# EAGLE design NRF52 CTAP Authenticator (EAGLE 9.6.2)
DRAWN: Steffensky; REV: A
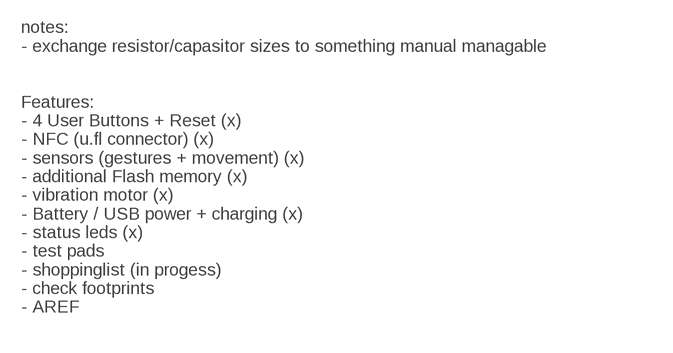
[diagram p0: schematic, sheet 1, part 1 of 2]
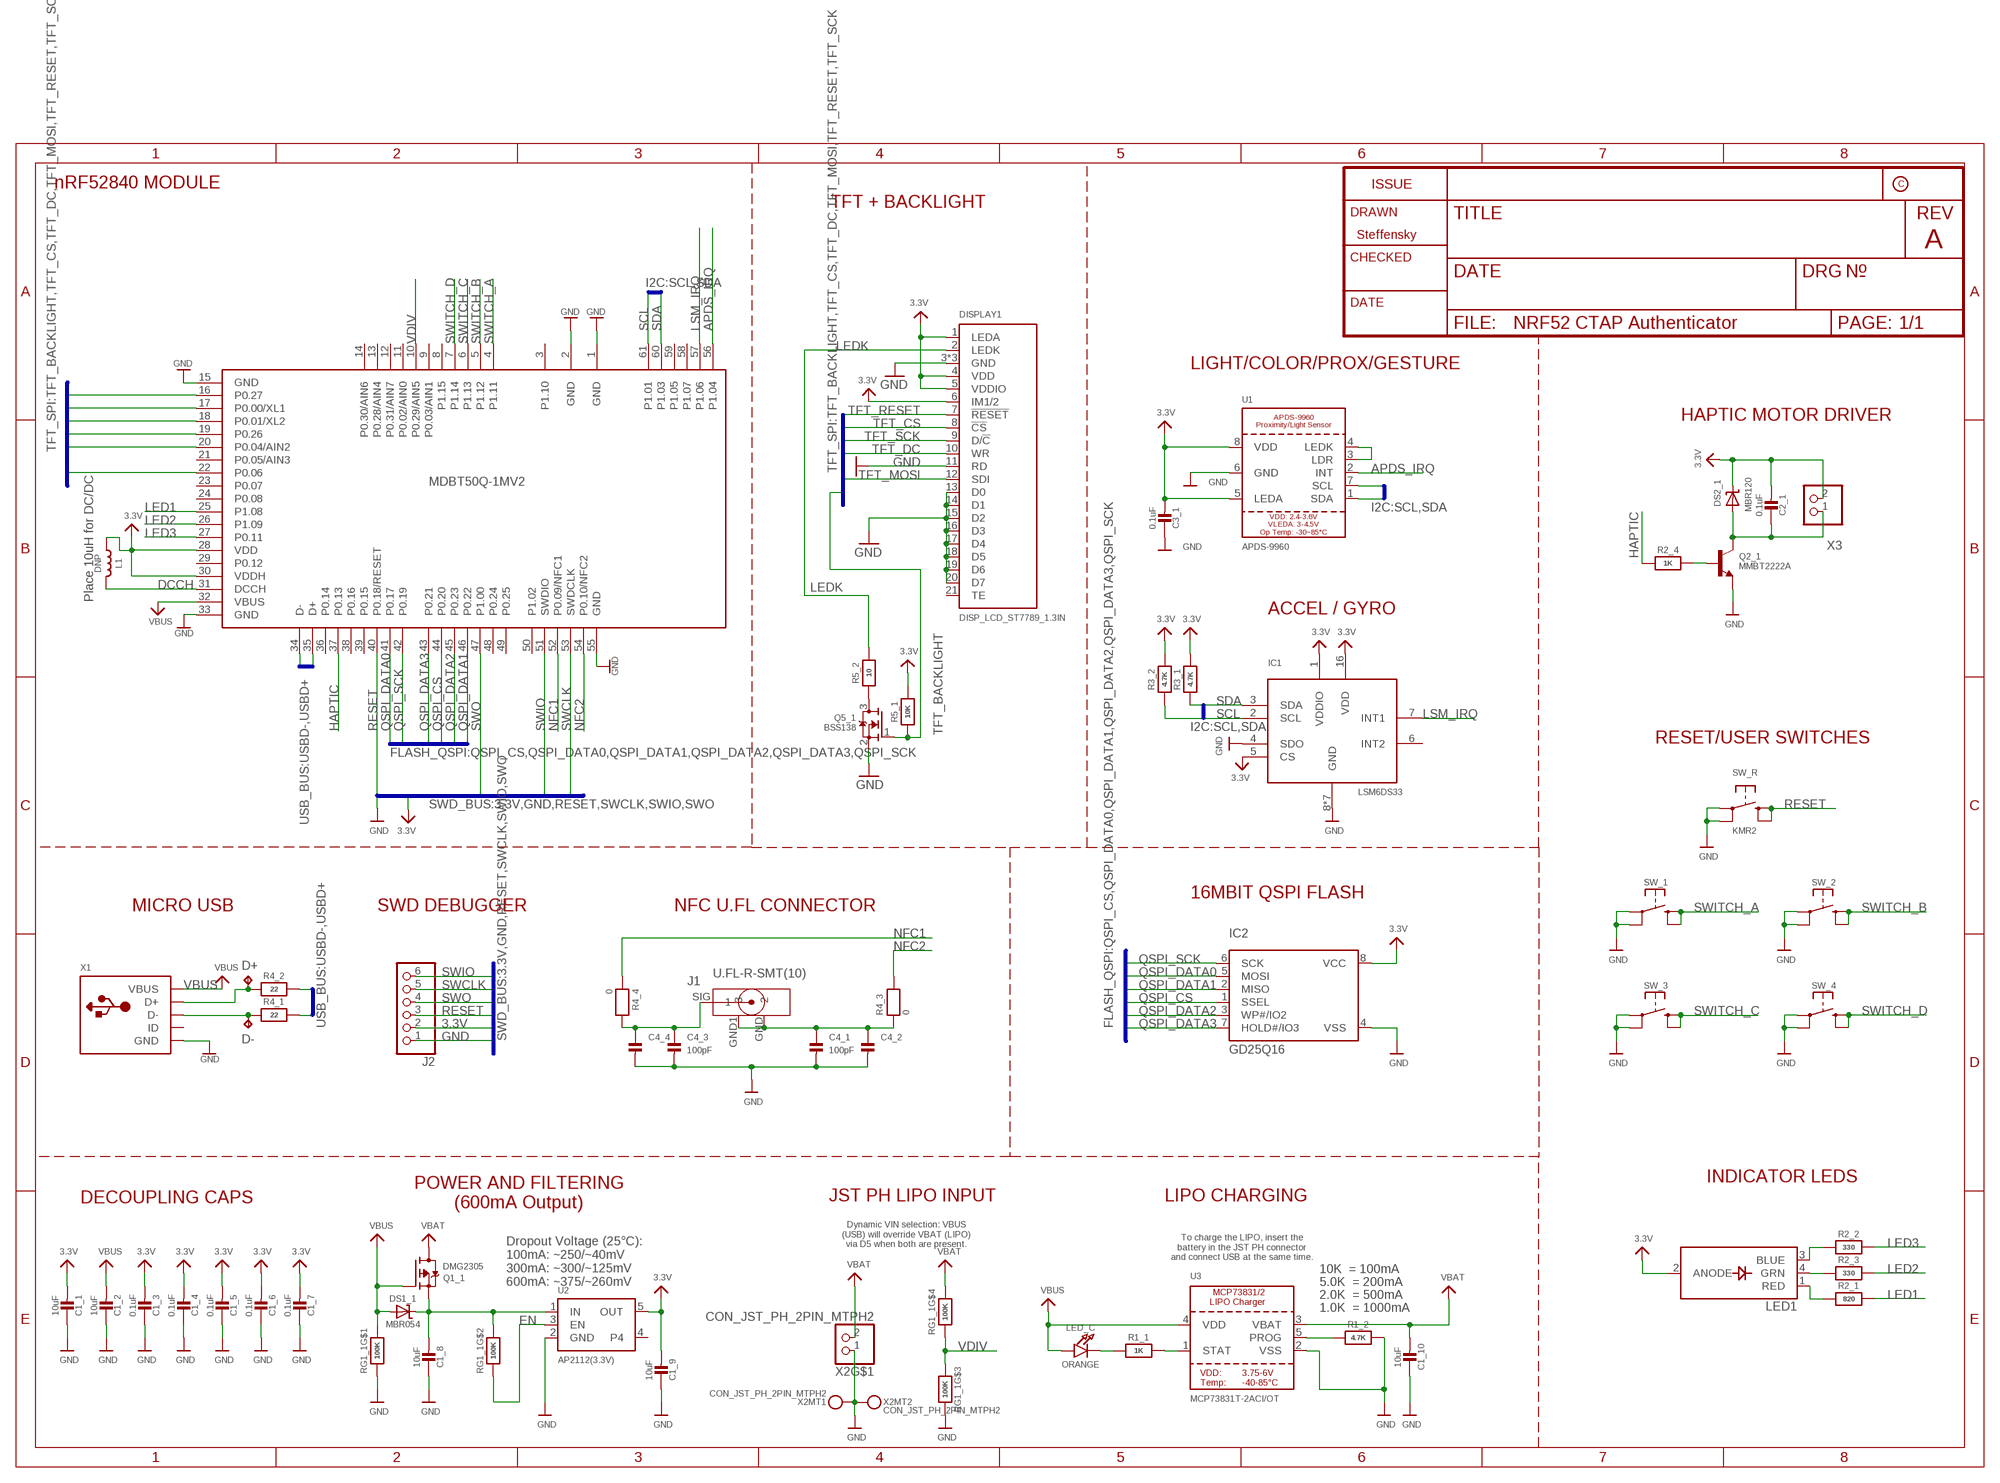
[diagram p1: schematic, sheet 1, part 2 of 2]
FRAME1 (FRAME_A3): DRAWN: Steffensky; REV: A

## Parts
C1_1  10uF  CAP_CERAMIC0805-NOTHERMALS  [0805_NOTHERMALS]
C1_2  10uF  CAP_CERAMIC0805-NOTHERMALS  [0805_NOTHERMALS]
C1_3  0.1uF  CAP_CERAMIC0805-NOTHERMALS  [0805_NOTHERMALS]
C1_4  0.1uF  CAP_CERAMIC0805-NOTHERMALS  [0805_NOTHERMALS]
C1_5  0.1uF  CAP_CERAMIC0805-NOTHERMALS  [0805_NOTHERMALS]
C1_6  0.1uF  CAP_CERAMIC0805-NOTHERMALS  [0805_NOTHERMALS]
C1_7  0.1uF  CAP_CERAMIC0805-NOTHERMALS  [0805_NOTHERMALS]
C1_8  10uF  CAP_CERAMIC0805-NOTHERMALS  [0805_NOTHERMALS]
C1_9  10uF  CAP_CERAMIC0805-NOTHERMALS  [0805_NOTHERMALS]
C1_10  10uF  CAP_CERAMIC0805-NOTHERMALS  [0805_NOTHERMALS]
C2_1  0.1uF  CAP_CERAMIC0805-NOTHERMALS  [0805_NOTHERMALS]
C3_1  0.1uF  CAP_CERAMIC0805-NOTHERMALS  [0805_NOTHERMALS]
C4_1  100pF  CAP_CERAMIC0805-NOTHERMALS  [0805_NOTHERMALS]
C4_2  CAP_CERAMIC0805-NOTHERMALS  [0805_NOTHERMALS]
C4_3  100pF  CAP_CERAMIC0805-NOTHERMALS  [0805_NOTHERMALS]
C4_4  CAP_CERAMIC0805-NOTHERMALS  [0805_NOTHERMALS]
D+  TPTP10R  [TP10R]
D-  TPTP10R  [TP10R]
DISPLAY1  DISP_LCD_ST7789_1.3IN  [TFT_1.3IN_240X240_24P]
DS1_1  MBR054  DIODE-SCHOTTKYSOD-123  [SOD-123]
DS2_1  MBR120  DIODE-SCHOTTKYSOD-123  [SOD-123]
IC1  LSM6DS33  [LGA16_3X3MM]
IC2  GD25Q16  SPIFLASH_8PIN  [SOIC8_150MIL]
J1  U.FL-R-SMT(10)  [U.FL-R-SMT(10)]
J2  HEADER-1X6ROUND  [1X06_ROUND]
L1  DNP  INDUCTOR_0805MP  [_0805MP]
LED1  LED_RGB_PLCC4  [RGBLED_PLCC4]
LED_C  ORANGE  LED0805_NOOUTLINE  [CHIPLED_0805_NOOUTLINE]
MDBT50Q-1MV2  MDBT50  [MDBT50]
Q1_1  DMG2305  MOSFET-P  [SOT23-R@1]
Q2_1  MMBT2222A  TRANSISTOR_NPN  [SOT23-R]
Q5_1  BSS138  MOSFET-NWIDE  [SOT23-WIDE]
R1_1  1K  RESISTOR0805_NOTHERMALS  [0805_NOTHERMALS]
R1_2  4.7K  RESISTOR0805_NOTHERMALS  [0805_NOTHERMALS]
R2_1  820  RESISTOR0805_NOTHERMALS  [0805_NOTHERMALS]
R2_2  330  RESISTOR0805_NOTHERMALS  [0805_NOTHERMALS]
R2_3  330  RESISTOR0805_NOTHERMALS  [0805_NOTHERMALS]
R2_4  1K  RESISTOR0805_NOTHERMALS  [0805_NOTHERMALS]
R3_1  4.7K  RESISTOR0805_NOTHERMALS  [0805_NOTHERMALS]
R3_2  4.7K  RESISTOR0805_NOTHERMALS  [0805_NOTHERMALS]
R4_1  22  RESISTOR0805_NOTHERMALS  [0805_NOTHERMALS]
R4_2  22  RESISTOR0805_NOTHERMALS  [0805_NOTHERMALS]
R4_3  0  RESISTOR0805_NOTHERMALS  [0805_NOTHERMALS]
R4_4  0  RESISTOR0805_NOTHERMALS  [0805_NOTHERMALS]
R5_1  10K  RESISTOR0805_NOTHERMALS  [0805_NOTHERMALS]
R5_2  10  RESISTOR0805_NOTHERMALS  [0805_NOTHERMALS]
RG1_1  100K  RESISTOR_4PACK  [RESPACK_4X0603]
SW_1  SWITCH_TACT_SMT_6MM  [6MMX6MM_TACTILE_SMT]
SW_2  SWITCH_TACT_SMT_6MM  [6MMX6MM_TACTILE_SMT]
SW_3  SWITCH_TACT_SMT_6MM  [6MMX6MM_TACTILE_SMT]
SW_4  SWITCH_TACT_SMT_6MM  [6MMX6MM_TACTILE_SMT]
SW_R  KMR2  SWITCH_TACT_SMT4.6X2.8  [BTN_KMR2_4.6X2.8]
U1  APDS-9960  [APDS-9960]
U2  AP2112(3.3V)  VREG_SOT23-5  [SOT23-5]
U3  MCP73831T-2ACI/OT  MCP73831/2  [SOT23-5]
X1  USB_MICRO_20329_V2  [4UCONN_20329_V2]
X2  CON_JST_PH_2PIN_MTPH2  [JSTPH2]
X3  CON_JST_PH_2PINPH2_NOTHERMALS  [JSTPH2_NOTHERMALS]

## Nets
3.3V [power]: C1_1.2 C1_3.2 C1_4.2 C1_5.2 C1_6.2 C1_7.2 C1_9.2 C2_1.2 C3_1.2 DISPLAY1.1(LEDA) DISPLAY1.4(VDD) DISPLAY1.5(VDDIO) DISPLAY1.6(IM1/2) DS2_1.C IC1.1(VDDIO) IC1.5(CS) IC1.16(VDD) IC2.8(VCC) J2.2 L1.1 LED1.2(ANODE) MDBT50Q-1MV2.28(VDD) MDBT50Q-1MV2.30(VDDH) R3_1.2 R3_2.2 R5_1.2 U1.5(LEDA) U1.8(VDD) U2.5(OUT) X3.2
APDS_IRQ: MDBT50Q-1MV2.56(P1.04) U1.2(INT)
D+: D+.TP R4_2.1 X1.D+
D-: D-.TP R4_1.1 X1.D-
DCCH: L1.2 MDBT50Q-1MV2.31(DCCH)
EN: RG1_1.2 U2.3(EN)
GND: C1_1.1 C1_2.1 C1_3.1 C1_4.1 C1_5.1 C1_6.1 C1_7.1 C1_8.1 C1_9.1 C1_10.1 C3_1.1 C4_1.2 C4_2.2 C4_3.2 C4_4.2 DISPLAY1.3(GND) DISPLAY1.11(RD) DISPLAY1.13(D0) DISPLAY1.14(D1) DISPLAY1.15(D2) DISPLAY1.16(D3) DISPLAY1.17(D4) DISPLAY1.18(D5) DISPLAY1.19(D6) DISPLAY1.20(D7) DISPLAY1.23(GND) DISPLAY1.24(GND) IC1.4(SDO) IC1.8(GND) IC1.9(GND) IC1.10(GND) IC1.11(GND) IC1.12(GND) IC1.13(GND) IC1.15(GND) IC2.4(VSS) J2.1 MDBT50Q-1MV2.1(GND) MDBT50Q-1MV2.2(GND) MDBT50Q-1MV2.15(GND) MDBT50Q-1MV2.33(GND) MDBT50Q-1MV2.55(GND) Q2_1.2(E) Q5_1.2(S) R1_2.2 RG1_1.1 RG1_1.6 SW_1.A'(P1) SW_1.A(P) SW_2.A'(P1) SW_2.A(P) SW_3.A'(P1) SW_3.A(P) SW_4.A'(P1) SW_4.A(P) SW_R.A'(P1) SW_R.A(P) U1.6(GND) U2.2(GND) U3.2(VSS) X1.BASE@1(GND) X1.BASE@2(GND) X1.GND X1.SPRT@1(GND) X1.SPRT@2(GND) X1.SPRT@3(GND) X1.SPRT@4(GND) X2.1 X2.NC1 X2.NC2
HAPTIC: MDBT50Q-1MV2.37(P0.13) R2_4.1
LED1: MDBT50Q-1MV2.25(P1.08) R2_1.2
LED2: MDBT50Q-1MV2.26(P1.09) R2_3.2
LED3: MDBT50Q-1MV2.27(P0.11) R2_2.2
LEDK: DISPLAY1.2(LEDK) R5_2.2
LSM_IRQ: IC1.7(INT1) MDBT50Q-1MV2.57(P1.06)
N$1: LED_C.C R1_1.1
N$2: U1.3(LDR) U1.4(LEDK)
N$3: LED1.3(BLUE) R2_2.1
N$4: Q5_1.3(D) R5_2.1
N$5: LED1.4(GRN) R2_3.1
N$6: C4_1.1 C4_2.1 J1.GND J1.GND1 R4_3.1
N$7: C2_1.1 DS2_1.A Q2_1.3(C) X3.1
N$8: C4_3.1 C4_4.1 J1.SIG R4_4.2
N$9: Q2_1.1(B) R2_4.2
N$10: LED1.1(RED) R2_1.1
N$11: R1_1.2 U3.1(STAT)
N$12: R1_2.1 U3.5(PROG)
NFC1: MDBT50Q-1MV2.52(P0.09/NFC1) R4_4.1
NFC2: MDBT50Q-1MV2.54(P0.10/NFC2) R4_3.2
QSPI_CS: IC2.1(SSEL) MDBT50Q-1MV2.44(P0.20)
QSPI_DATA0: IC2.5(MOSI) MDBT50Q-1MV2.41(P0.17)
QSPI_DATA1: IC2.2(MISO) MDBT50Q-1MV2.46(P0.22)
QSPI_DATA2: IC2.3(WP#/IO2) MDBT50Q-1MV2.45(P0.23)
QSPI_DATA3: IC2.7(HOLD#/IO3) MDBT50Q-1MV2.43(P0.21)
QSPI_SCK: IC2.6(SCK) MDBT50Q-1MV2.42(P0.19)
RESET: J2.3 MDBT50Q-1MV2.40(P0.18/RESET) SW_R.B'(S1) SW_R.B(S)
SCL: IC1.2(SCL) MDBT50Q-1MV2.61(P1.01) R3_2.1 U1.7(SCL)
SDA: IC1.3(SDA) MDBT50Q-1MV2.60(P1.03) R3_1.1 U1.1(SDA)
SWCLK: J2.5 MDBT50Q-1MV2.53(SWDCLK)
SWIO: J2.6 MDBT50Q-1MV2.51(SWDIO)
SWITCH_A: MDBT50Q-1MV2.4(P1.11) SW_1.B'(S1) SW_1.B(S)
SWITCH_B: MDBT50Q-1MV2.5(P1.12) SW_2.B'(S1) SW_2.B(S)
SWITCH_C: MDBT50Q-1MV2.6(P1.13) SW_3.B'(S1) SW_3.B(S)
SWITCH_D: MDBT50Q-1MV2.7(P1.14) SW_4.B'(S1) SW_4.B(S)
SWO: J2.4 MDBT50Q-1MV2.47(P1.00)
TFT_BACKLIGHT: MDBT50Q-1MV2.16(P0.27) Q5_1.1(G) R5_1.1
TFT_CS: DISPLAY1.8(!CS) MDBT50Q-1MV2.18(P0.01/XL2)
TFT_DC: DISPLAY1.10(WR) MDBT50Q-1MV2.20(P0.04/AIN2)
TFT_MOSI: DISPLAY1.12(SDI) MDBT50Q-1MV2.22(P0.06)
TFT_RESET: DISPLAY1.7(!RESET) MDBT50Q-1MV2.17(P0.00/XL1)
TFT_SCK: DISPLAY1.9(D/!C) MDBT50Q-1MV2.19(P0.26)
USBD+: MDBT50Q-1MV2.35(D+) R4_2.2
USBD-: MDBT50Q-1MV2.34(D-) R4_1.2
VBAT [power]: C1_10.2 Q1_1.3(D) RG1_1.5 U3.3(VBAT) X2.2
VBUS [power]: C1_2.2 DS1_1.A LED_C.A MDBT50Q-1MV2.32(VBUS) Q1_1.1(G) RG1_1.8 U3.4(VDD) X1.VBUS
VDIV: MDBT50Q-1MV2.10(P0.29/AIN5) RG1_1.3 RG1_1.4
VHI [power]: C1_8.2 DS1_1.C Q1_1.2(S) RG1_1.7 U2.1(IN)
Unconnected: DISPLAY1.21(TE) IC1.6(INT2) MDBT50Q-1MV2.3(P1.10) MDBT50Q-1MV2.8(P1.15) MDBT50Q-1MV2.9(P0.03/AIN1) MDBT50Q-1MV2.11(P0.02/AIN0) MDBT50Q-1MV2.12(P0.31/AIN7) MDBT50Q-1MV2.13(P0.28/AIN4) MDBT50Q-1MV2.14(P0.30/AIN6) MDBT50Q-1MV2.21(P0.05/AIN3) MDBT50Q-1MV2.23(P0.07) MDBT50Q-1MV2.24(P0.08) MDBT50Q-1MV2.29(P0.12) MDBT50Q-1MV2.36(P0.14) MDBT50Q-1MV2.38(P0.16) MDBT50Q-1MV2.39(P0.15) MDBT50Q-1MV2.48(P0.24) MDBT50Q-1MV2.49(P0.25) MDBT50Q-1MV2.50(P1.02) MDBT50Q-1MV2.58(P1.07) MDBT50Q-1MV2.59(P1.05) U2.4 X1.ID

## Buses
TFT_SPI:TFT_BACKLIGHT,TFT_CS,TFT_DC,TFT_MOSI,TFT_RESET,TFT_SCK
FLASH_QSPI:QSPI_CS,QSPI_DATA0,QSPI_DATA1,QSPI_DATA2,QSPI_DATA3,QSPI_SCK
I2C:SCL,SDA
SWD_BUS:3.3V,GND,RESET,SWCLK,SWIO,SWO
USB_BUS:USBD-,USBD+

## Notes on the sheet
- nRF52840 MODULE
- TFT + BACKLIGHT
- notes:
  - exchange resistor/capasitor sizes to something manual managable
  
  
  Features:
  - 4 User Buttons + Reset (x)
  - NFC (u.fl connector) (x)
  - sensors (gestures + movement) (x)
  - additional Flash memory (x)
  - vibration motor (x)
  - Battery / USB power + charging (x)
  - status leds (x)
  - test pads
  - shoppinglist (in progess)
  - check footprints
  - AREF
- LIGHT/COLOR/PROX/GESTURE
- HAPTIC MOTOR DRIVER
- Place 10uH for DC/DC
- ACCEL / GYRO
- RESET/USER SWITCHES
- 16MBIT QSPI FLASH
- MICRO USB | SWD DEBUGGER | NFC U.FL CONNECTOR
- INDICATOR LEDS
- DECOUPLING CAPS | JST PH LIPO INPUT | LIPO CHARGING
- POWER AND FILTERING
  (600mA Output)
- Dynamic VIN selection: VBUS
  (USB) will override VBAT (LIPO)
  via D5 when both are present.
- To charge the LIPO, insert the
  battery in the JST PH connector
  and connect USB at the same time.
- 10K  = 100mA
- Dropout Voltage (25°C):
  100mA: ~250/~40mV
  300mA: ~300/~125mV
  600mA: ~375/~260mV
- 5.0K  = 200mA
- 2.0K  = 500mA
- 1.0K  = 1000mA

## Library data of the parts
C1_1-C1_10 C2_1 C3_1 C4_1-C4_4 = microbuilder:CAP_CERAMIC: Ceramic Capacitors 0402 - 0402 Surface Mount Capacitors 16pF 50V 5% [Digikey: 445-4899-2-ND] 18pF 50V 5% [Digikey: 490-1281-2-ND] 22pF 50V 5% [Digikey: 490-1283-2-ND] 68pF 50V 5% [Digikey: 490-1289-2-ND] 0.1uF 10V 10% [Digikey: 490-1318-2-ND] 1.0uF 6.3V 10% [Digikey: 490-1320-2-ND] 0603 - 0603 Surface Mount Capacitors 16 pF 50V 5% [Digikey: 445-5051-2-ND] 22 pF 50V [Digikey: PCC220ACVTR-ND] 33 pF 50V 5% [Digikey: 490-1415-1-ND] 56pF 50V 5% [Digikey: 490-1421-1-ND] 220pF 50V 5% [Digikey: 445-1285-1-ND] 680 pF 50V 2200 pF 50V 5% C0G [Digikey: 445-1297-1-ND] 5600 pF 100V 5% X7R [Digikey: 478-3711-1-ND] 0.1 µF 25V 10% [Digikey: PCC2277TR-ND] 0.22 µF 16V 10% X7R [Digikey: 445-1318-1-ND] 1.0 µF 25V 10% [Digikey: 445-5146-2-ND] 0603 - RF Specific 3pF 250V +/-0.1pF RF [Digikey: 712-1347-1-ND] 18 pF 250V 5% [Digikey: 478-3505-1-ND or 712-1322-1-ND] 56 pF 250V 5% C0G RF [Digikey: 490-4867-1-ND] 68 pF 250V RF [Digikey: 490-4868-1-ND] 0805 - 0805 Surface Mount Capacitors 220 pF 250V 2% RF Ceramic Capacitor [Digikey: 712-1398-1-ND] 1000 pF 50V 2% NP0 Ceramic Capacitor [Digikey: 478-3760-1-ND] 0.1 µF 25V 10% Ceramic Capacitor [Digikey: PCC1828TR-ND] 1.0 µF 16V 10% Ceramic Capacitor[Digikey: 490-1691-2-ND] 10.0 µF 10V 10% Ceramic Capacitor[Digikey: 709-1228-1-ND] 10.0 uF 16V 10% Ceramic Capacitor [Digikey: 478-5165-2-ND] 47 uF 6.3V 20% Ceramic Capacitor [Digikey: 587-1779-1-ND or 399-5506-1-ND] 1206 - 1206 Surface Mount Capacitors 47uF 10V 20% Ceramic Capacitor [Digikey: 490-5528-1-ND or 399-5508-1-ND or 445-6010-1-ND] 100uF 6.3V -20%, +80% Y5V Ceramic Capacitor (Digikey: 490-4512-1-ND, Mouser: 81-GRM31CF50J107ZE1L)
D+ D- = testpad:TP: Test pad
DISPLAY1 = adafruit_display:DISP_LCD_ST7789_1.3IN
DS1_1 DS2_1 = CLUE_microbuilder:DIODE-SCHOTTKY
IC1 = adafruit_sensor:LSM6DS33
IC2 = CLUE_microbuilder:SPIFLASH_8PIN: SOIC8 SPI Flash Be careful with the size since SOIC8 flash comes in several 'widths' SOIC8 150 mil M25P16 - 16Mbit (2Mbit x 8) Serial Flash (75MHz SPI Bus), Supply: 2.7-3.6V Digikey: SOIC8 - M25P16-VMN6P-ND SOIC8 208 mil W25Q16BVSSIG - 16Mbit (2Mbit x 8) Serial Flash (104MHz SPI Bus), Supply: 2.7-3.6V Digikey: SOIC8 - W25Q16BVSSIG-ND
J1 = Connectors:U.FL-R-SMT(10): CONN U.FL RCPT STR 50 OHM SMD Manufacturer's datasheet <https://media.digikey.com/pdf/Data%20Sheets/Hirose%20PDFs/UFL%20Series.pdf>; CREATED_BY: PCBLayout.com; DIGIKEY_PART_NUMBER: H9161CT-ND; MANUFACTURER: Hirose Electric Co Ltd; MPN: U.FL-R-SMT(10); PACKAGE: SMD
J2 = microbuilder:HEADER-1X6: PIN HEADER
L1 = microbuilder:INDUCTOR: Inductors 0603: 10nH Ceramic Inductor - microwire antenna/RF (Digikey: 712-1434-2-ND) 0805: 560nH Ceramic Inductor - RF (Digikey: 553-1047-1-ND) 270nH Ceramic Inductor - Q = 40@250MHz, +-5%, 1 Ohm DC Resistance (Digikey: 535-10506-2-ND) 1007 (2518 Metric) SMT: 10µH 10% 250mOhm 820mA 1007 Inductor (Digikey: 587-2189-1-ND) 22µH 10% 500mOhm 580mA 1007 Inductor (Digikey: 587-2190-1-ND) 47µH 10% 950mOhm 420mA 1007 Inductor (Digikey: 587-2191-1-ND) 47µH 5% 100mOhm 1A 1008 Inductor (Digikey: 732-1816-1-ND) 5.0x5.0mm (Taiyo Yuden NR5040 Series) 6.8µH 20% 2.3A 64mOhm Inductor (Digikey: 587-2374-2-ND) 5.0x5.0mm (TDK VLC5045 Series) 4.7µH 20% 3.3A 34mOhm Inductor (Digikey: 445-6526-1-ND) 6.8µH 20% 2.7A 46mOhm Inductor (Digikey: 445-6527-1-ND) 6.0x6.0mm (TDK VLC6045 Series) 4.7µH 20% 3.8A 27mOhm Inductor (Digikey: 445-6538-2-ND) 6.8µH 20% 3A 41mOhm Inductor (Digikey: 445-6540-1-ND) 6.2µH 30% 2.2A 45mOhm Inductor (Digikey: SRR5028-6R2YCT-ND) - Not TDK VLC6045 but footprint should match 6.0x6.0mm (TDK SLF6045 Series) 6.8uH 30% 2A 33mOhm Inductor (Digikey: 445-4572-1-ND, Mouser: 810-SLF645T6R8N2R0PF)
LED1 = microbuilder:LED_RGB_PLCC4: RGB LED - PLCC4 Cree 20mA Common Anode Digikey: CLV1A-FKB-CJ1M1F1BB7R4S3CT-ND Red: 2.6V Vf, 550mcd Green: 3.2V Vf, 850mcd Blue: 3.2V Vf, 320mcd
LED_C = microbuilder:LED: LED 0603 - 0603 Surface Mount Package 2mA: Green LED - Low Power (3.9mcd, 2ma, 1.7Vf) - Digikey: 475-2709-2-ND Orange LED - Low Power (9.8mcd, 2ma, 1.8Vf) - Digikey: 475-1194-2-ND Red LED - Low Power (5mcd, 2ma, 1.8Vf) - Digikey: 475-1195-2-ND Yellow LED - Low Power (7mcd, 2ma, 1.8Vf) - Digikey: 475-1196-2-ND 5mA: Blue LED - Low Power (17mcd, 5ma, 2.9Vf) - Digikey: LNJ937W8CRACT-ND 0805 - 0805 Surface Mount Package 2mA: Red LED (8.8mcd, 2mA, 1.8Vf, Clear) - Low Power [Digikey: 475-2510-1-ND] Green LED (5mcd, 2mA, 1.8Vf, Clear) - Low Power [Digikey: 475-2730-1-ND] Yellow LED (11.3mcd, 2mA, 1.8Vf, Clear) - Low Power [Digikey: 475-2555-1-ND] 20mA: Red LED (104mcd, 20mA, Diffused) - LS R976 [Digikey: 475-1278-6-ND] Red LED (12mcd, 20mA, 2.0Vf, Clear) - APT2012EC [Digikey: 754-1128-1-ND] Green LED (15mcd, 20mA, 2.2Vf, Clear) - APT2012GC [Digikey: 754-1131-1-ND] Orange LED (160mcd, 20mA, 2.1Vf, Clear) - APT2012SECK [Digikey: 754-1130-1-ND] 1206 - 1206 Surface Mount Package Green LED (26mcd, 20mA, Diffused) - LG N971 [Digikey: 475-1407-6-ND] Red LED (15mcd, 20mA, Diffused) - LH N974 [Digikey: 475-1416-6-ND] Cree - Cree High-Power Surface Mount LEDs XPEBWT-L1-0000-00D50 - White 111lm 350mA 2.9Vf 6200K 110° XTEAWT-00-0000-00000LEE3 - White 114lm 350mA 2.85Vf 5000K 115° Everlight - Everlight 45-21 Series Surface Mount LEDs 45-21/QK2C-B2832AC2CB2/2T - Warm White 2000mcd 20mA 3.25Vf 3050K 120° 45-21/LK2C-B38452C4CB2/2T - Nuetral White 2000mcd 20mA 3.25Vf 4150K 120° 45-21/LK2C-B50634C6CB2/2T - Cold White 2200mcd 20mA 3.25Vf 5650K 120° PLCC2 Reverse Mount LS T77K-J1L2-1-0-2-R18-Z - Red 11.25mcd 2mA 1.8Vf 630nm 120° LO T77K-L1M2-24-Z - Orange 19.6mcd 2mA 1.8Vf 606nm 120° LY T77K-K2M1-26-Z - Yellow 15.7mcd 2mA 1.8Vf 587nm 120°
MDBT50Q-1MV2 = MDBT50Q_171031:MDBT50: Raytac Corporation MDBT50 Bluetooth Low Energy Module based on Noridc nRF52840 Source: Raytac datasheet
Q1_1 = microbuilder:MOSFET-P: P-Channel Mosfet LEGEND VDS: Voltage Drain-Source ID: Drain Current RDS(ON): Drain-Source On-State Resistance VGS(TH): Gate-Source Threshold Voltage CISS: Drain-Source Input Capacitance SOT-23 Name VDS ID RDS(ON) VGS(TH) CISS Order Number IRLML5103 30V 760mA 600 mOhm -- 75pF @ 25V Digikey: IRLML5103PBFCT-ND IRLML6401 12V 4.3A 50 mOhm 950mV @ 250µA 830pF @ 10V Digikey: IRLML6401PBFTR-ND NTR0202PL 20V 400mA 800 mOhm 2.3V @ 250uA 70pF @ 5V Digikey: NTR0202PLT1GOSTR-ND NTR4101PT1G 20V 1.8A 85 mOhm 1.2V @ 250uA 675pF @ 10V Digikey: NTR4101PT1GOSCT-ND DMP2004K 20V 600mA 900 mOhm 1V @ 250uA 175pF @ 16V Digikey: DMP2004KDICT-ND PMV65XP 20V 3.9A 76 mOhm 950mV @ 1mA 725pF @ 20V Digikey: 568-2358-2-ND TO-252 Name VDS ID RDS(ON) VGS(TH) CISS Order Number AOD417 30V 25A 34 mOhm 3V @ 250µA 920pF @ 15V Digikey: 785-1106-2-ND PowerPak Name VDS ID RDS(ON) VGS(TH) CISS Order Number AON7401 30V 12A 14 mOhm 3V @ 250µA 2600pF @ 15V Digikey: 785-1302-1-ND
Q2_1 = microbuilder:TRANSISTOR_NPN: NPN Transistor Transistor (NPN) 500mA 45V - BC817 [Digikey: 568-1631-1-ND] Transistor (NPN) 500mA 45V - BC817,215 [Mouser: 771-BC817-T/R] SOT23-R - SOT23 footprint optimised for use with solder paste and reflow ovens. SOT23-W - SOT23 footprint optimised for hand-soldering (larger pads).
Q5_1 = microbuilder:MOSFET-N: N-Channel Mosfet LEGEND VDS: Voltage Drain-Source ID: Drain Current RDS(ON): Drain-Source On-State Resistance VGS(TH): Gate-Source Threshold Voltage CISS: Drain-Source Input Capacitance SOT-23 Name VDS ID RDS(ON) VGS(TH) CISS Order Number 2N7002E 60V 260mA 2.5 Ohm 2.5V @ 250uA 26.7pF @ 25V 2N7002ET1GOSTR-ND BSH103 30V 850mA 400 mOhm 400mV @ 1mA 83pF @ 24V BSH103,235-ND BSS138 60V 320mA 1.6 Ohm 1.5V @ 250uA 50pF @ 10V Mouser: 771-BSS138PW115 DMN2075U-7 20V 4.2A 38 mOhm 1V @ 250 uA 594.3pF @ 10V DMN2075U-7DICT-ND * BSS138 good choice for I2C level-shifting
R1_1 R1_2 R2_1-R2_4 R3_1 R3_2 R4_1-R4_4 R5_1 R5_2 = microbuilder:RESISTOR: Resistors 0402 - 0402 Surface Mount Package 22 Ohm 1% 1/16W [Digikey: 311-22.0LRTR-ND] 33 Ohm 5% 1/16W 1.0K 5% 1/16W 1.5K 5% 1/16W 2.0K 1% 1/16W 10.0K 1% 1/16W [Digikey: 311-10.0KLRTR-ND] 10.0K 5% 1/16W [Digikey: RMCF0402JT10K0TR-ND] 12.1K 1% 1/16W [Digikey: 311-22.0LRTR-ND] 100.0K 5% 1/16W 0603 - 0603 Surface Mount Package 0 Ohm 1/10 Watt 1% Resistor 15 Ohm 1/10 Watt 1% Resistor 33 Ohm 1/10 Watt 1% Resistor 49.9 Ohm 1/10 Watt 1% Resistor 100 Ohm 1/10 Watt 1% Resistor 150 Ohm 1/10 Watt 1% Resistor 240 Ohm 1/10 Watt 1% Resistor 390 Ohm 1/10 Watt 1% Resistor 560 Ohm 1/10 Watt 1% Resistor 680 Ohm 1/10 Watt 1% Resistor 750 Ohm 1/10 Watt 1% Resistor 1.0K Ohm 1/10 Watt 1% Resistor 1.5K Ohm 1/10 Watt 1% Resistor 2.0K Ohm 1/10 Watt 1% Resistor 2.2K Ohm 1/10 Watt 1% Resistor 3.3K Ohm 1/10 Watt 1% Resistor 4.7K Ohm 1/10 Watt 1% Resistor 10.0K Ohm 1/10 Watt 1% Resistor 12.0K Ohm 1/10 Watt 1% Resistor 12.1K Ohm 1/10 Watt 1% Resistor 20.0K Ohm 1/10 Watt 1% Resistor 33.0K Ohm 1/10 Watt 1% Resistor 100.0K Ohm 1/10 Watt 1% Resistor 0805 - 0805 Surface Mount Package 0 Ohm 1/8 Watt 1% Resistor 33 Ohm 1/8 Watt 1% Resistor 100 Ohm 1/8 Watt 1% Resistor 150 Ohm 1/8 Watt 1% Resistor 200 Ohm 1/8 Watt 1% Resistor 240 Ohm 1/8 Watt 1% Resistor 330 Ohm 1/8 Watt 1% Resistor 390 Ohm 1/8 Watt 1% Resistor 470 Ohm 1/8 Watt 1% Resistor 1.0K Ohm 1/8 Watt 1% Resistor 1.5K Ohm 1/8 Watt 1% Resistor 2.0K Ohm 1/8 Watt 1% Resistor 4.7K Ohm 1/8 Watt 1% Resistor 5.1K Ohm 1/8 Watt 1% Resistor 5.6K Ohm 1/8 Watt 1% Resistor 10.0K Ohm 1/8 Watt 1% Resistor 22.0K Ohm 1/8 Watt 1% Resistor 33.0K Ohm 1/8 Watt 1% Resistor 100K Ohm 1/8 Watt 1% Resistor 1206 - 1206 Surface Mount Package 2012 - 2010 Surface Mount Package 0.11 Ohm 1/2 Watt 1% Resistor - Digikey: RHM.11UCT-ND
RG1_1 = microbuilder:RESISTOR_4PACK: Resistor Packs (4 resistors) 4 x 0603 10K 1/16W - Digikey: YC164J-10KCT-ND
SW_1-SW_4 = CLUE_microbuilder:SWITCH_TACT_SMT: SMT Tact Switches 6x6mm - Digikey: P12940SCT-ND KMR2 (4.6x2.8mm) - Digikey: 401-1426-1-ND EVQ-PQHB55 - Light Touch, 160GF (4.5x4.5mm) - Digikey: P8090SCT-ND KMT0 - KMT021 NGJ LHS (etc.) IP68/Waterproof - Digikey: CKN10289CT-ND
SW_R = microbuilder:SWITCH_TACT_SMT: SMT Tact Switches 6x6mm - Digikey: P12940SCT-ND KMR2 (4.6x2.8mm) - Digikey: 401-1426-1-ND EVQ-PQHB55 - Light Touch, 160GF (4.5x4.5mm) - Digikey: P8090SCT-ND KMT0 - KMT021 NGJ LHS (etc.) IP68/Waterproof - Digikey: CKN10289CT-ND
U1 = adafruit_sensor:APDS-9960: APDS-9960 - Digital Proximity Sensor with Ambient Light/RGB/Gesture Detection
U2 = microbuilder:VREG_SOT23-5: SOT23-5 Fixed Voltage Regulators Part Current Out V Out V In V Dropout θJA (°C/W) TJ (°C) Digikey Part No. ADP121 150mA 3.3V 3.4-5.5V 0.09V @ 150mA -- -- ADP121-AUJZ33R7CT-ND ADP121 150mA 3.0V 3.1-5.5V 0.09V @ 150mA -- -- ADP121-AUJZ30R7CT-ND ADP122 300mA 3.3V 3.4-5.5V 0.085V @ 300mA -- -- ADP122AUJZ-3.3-R7CT-ND ADP1712 300mA 3.3V 3.5-5.5V 0.17V @ 300mA -- -- ADP1712AUJZ-3.3-R7TR-ND AP7311 (Low Cost) 150mA 3.3V 3.5-6V 0.15V @ 150mA -- -- AP7311-33WG-7DICT-ND LD39015M18R 150mA 1.8V 1.9V-5.5V 0.08V @ 100mA -- -- 497-6977-1-ND LP2985A-33DBVR 150mA 3.3V 3.3-16V 0.28V @ 150mA 206 150 296-18479-1-ND MCP1824T-3302E/OT 300mA 3.3V 3.5V-6V 0.2V @ 300mA -- -- MCP1824T-3302E/OTCT-ND MIC5205-2.5YM5 TR 150mA 2.5V 2.7-16V 0.165V @ 150mA -- -- 576-1257-2-ND MIC5205-3.0YM5 TR 150mA 3.0V 3.2V-16V 0.165V @ 150mA -- -- 576-1258-2-ND MIC5205-3.3YM5 TR 150mA 3.3V 3.5V-16V 0.165V @ 150mA -- -- 576-1259-2-ND TPS780330220 150mA 3.3V+2.2V 3.6-5.5V 250mV Max -- -- 296-23332-1-ND TDA3663/N1,135 100mA 3.3V 3.5-45V 0.18V @ 50mA -- -- 568-5343-1-ND Max operating temp can be calculated using θJA, TJ (max junction temperature), and power in watts. Set the "Maximum Ambient Temperature" until it reaches TJ ("Max Junction Temperature"), which is the absolute limit for safe use of the regulator: Heat Sink Temperature Calculator <http://www.daycounter.com/Calculators/Heat-Sink-Temperature-Calculator.phtml> For example, With 12V source into a 3.3V LP2985 and a 30mA load, we are dissipating (12V-3.3V) * 0.03A = 0.261W. With a θJA of 206 °C/W, a TJ of 150°C, and 261mW we can safely use the chip without a heat sink up to 75°C (=147.1°C Junction Temperature).
U3 = microbuilder:MCP73831/2: MCP73831/2 LIPO Charger VDD: 3.75 - 6V Temp -40 - 85°C Programmable Charge Rate: 15-500mA NOTE: STAT is a tri-state logic output on the MCP73831 and an open-drain output on the MCP73832. SOT23-5 with 4.2V output and tri-state logic on STAT = MCP73831T-2ACI/OT
X1 = CLUE_microbuilder:USB: USB Connectors USBMINIB - Surface Mount Female Mini-B USB Connector 4UConnector: 06564
X2 = microbuilder:CON_JST_PH_2PIN_MT
X3 = CLUE_microbuilder:CON_JST_PH_2PIN: JST 2-Pin Right-Angle Connector PH-Series - 4UConnector: 17311 SH-Series - 4UConnector: 07278

## Net classes
0 default: width 0.203 mm, clearance 0.205 mm
1 power: width 0.406 mm, clearance 0.205 mm to class 0, clearance 0.205 mm

## Board
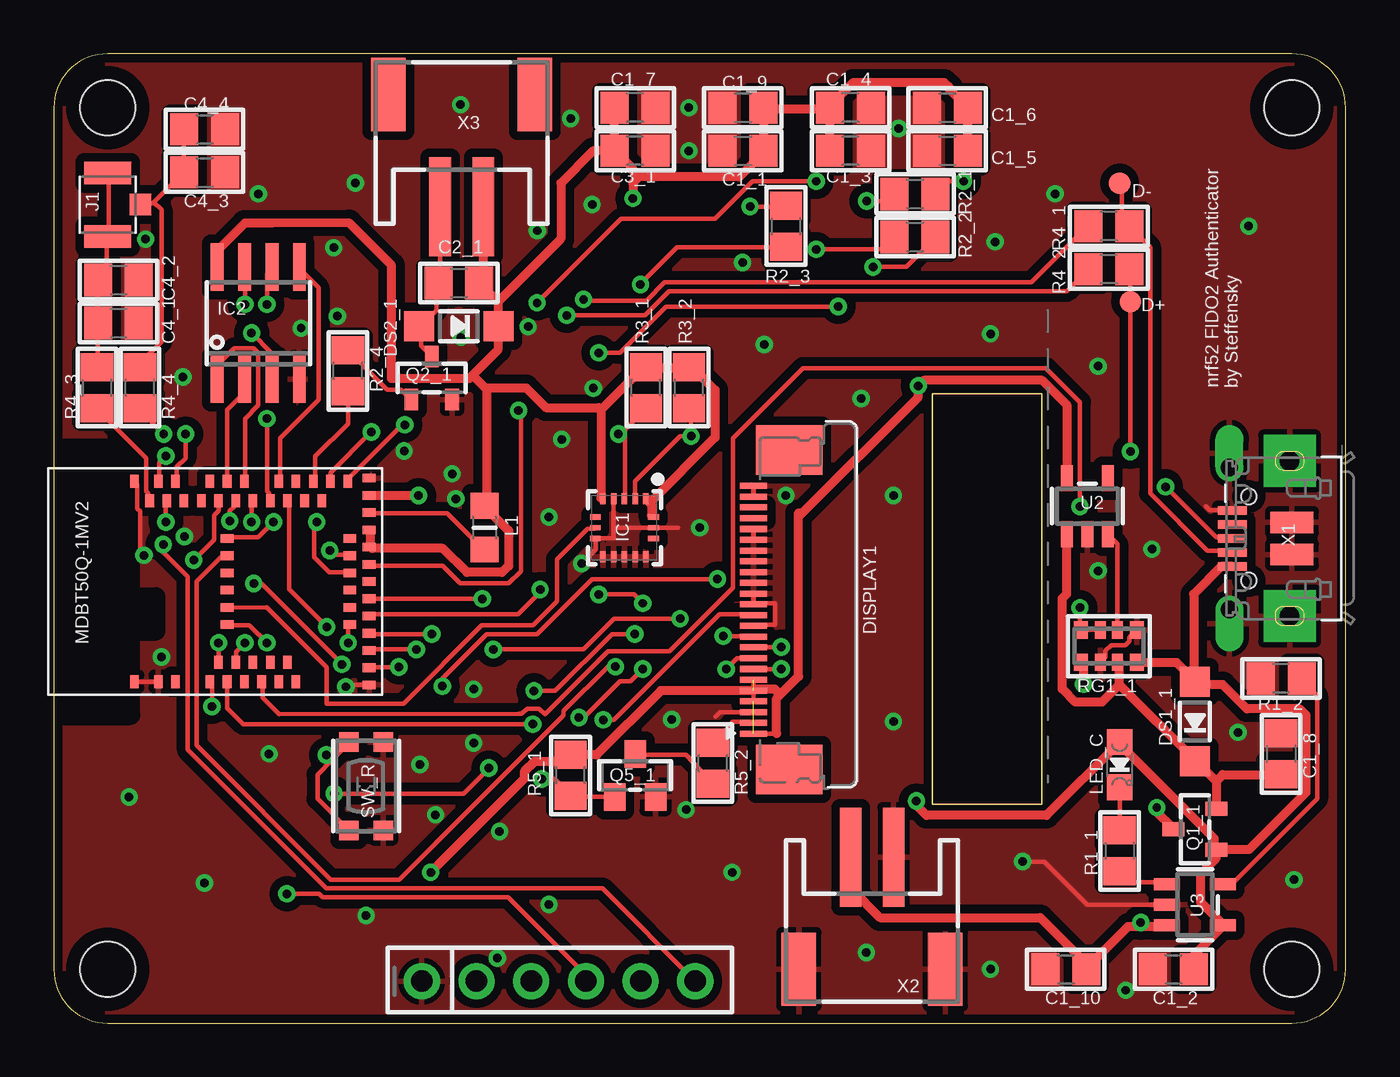
[diagram p2: board, top side]
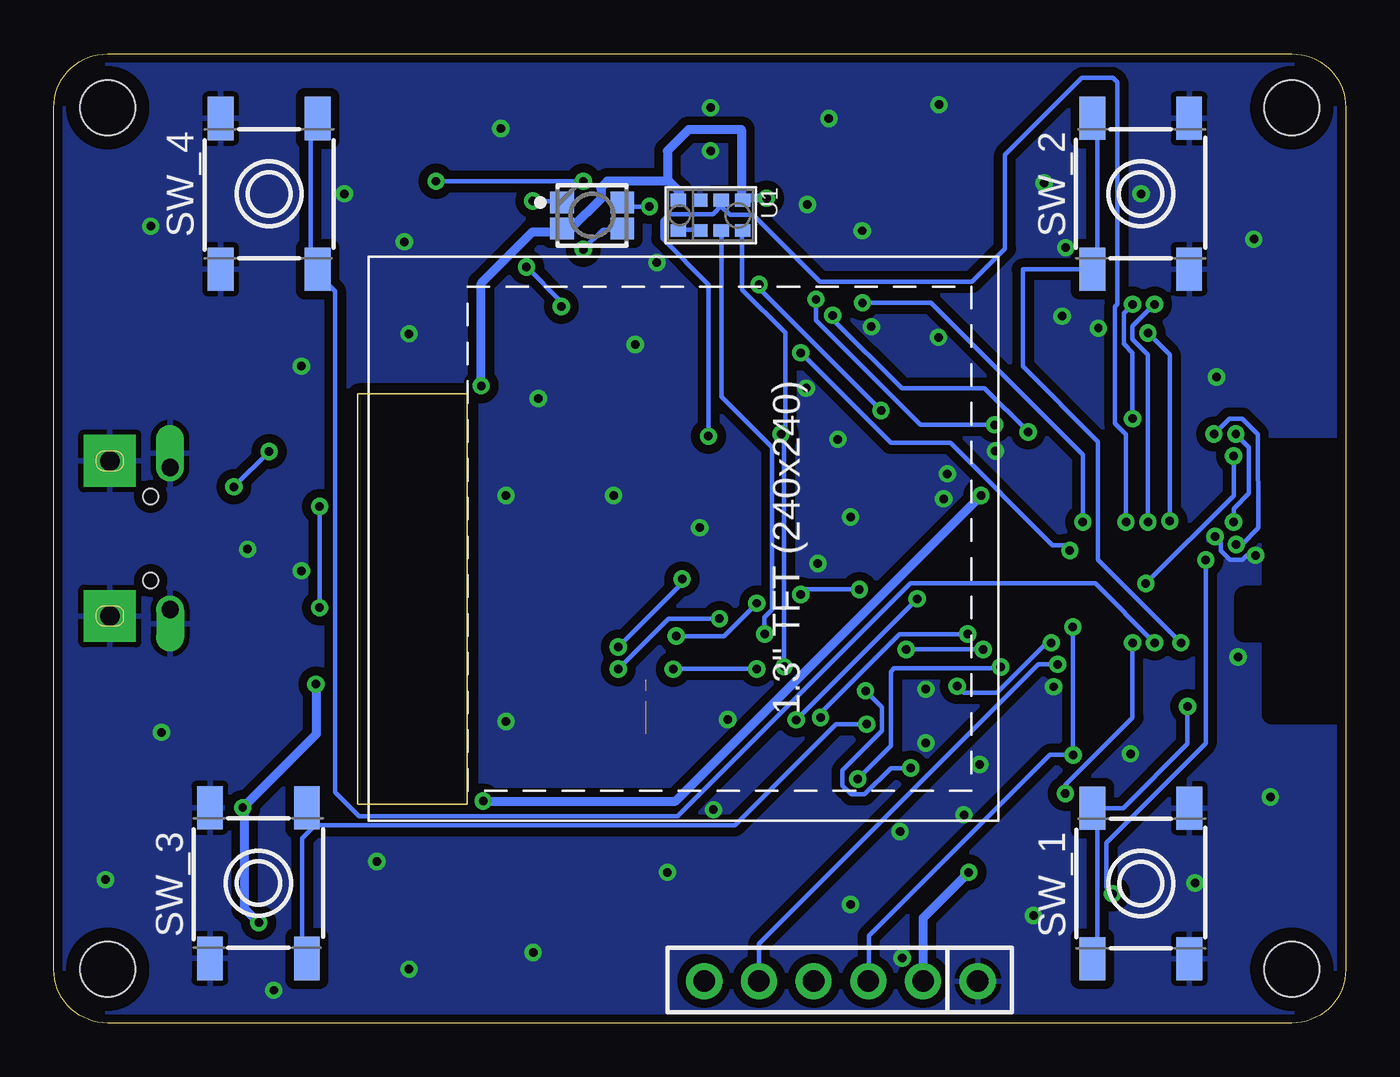
[diagram p3: board, bottom side, seen from below]

Size 60 x 45 mm. Coordinates in mm from the lower left corner, seen from the top.
Outline: 0,42.5 0,2.5 arc90 2.5,0 57.5,0 arc90 60,2.5 60,42.5 arc90 57.5,45 2.5,45 arc90 0,42.5
Outline: 45.88,10.16 40.8,10.16 40.8,29.21 45.88,29.21 45.88,10.16
Copper layers (1*16): Top 0.035mm / dielectric 1.5mm / Bottom 0.035mm
Design rules "adafruit": minimum track width 8mil, minimum drill 15.5mil, track to track 8mil, track to pad 8mil, pad to pad 8mil, via to via 8mil, smd to smd 8mil, copper to edge 10mil, drill to drill 8mil, minimum pad ring 10mil, minimum via ring 8mil, stop-mask expansion 2mil, vias tented up to drill 20mil, thermal gap 10mil
Holes 2.54 mm at 57.5,42.5 57.5,2.5 2.5,2.5 2.5,42.5
tKeepout: area 0,14.4 to 3.6,26.7; area 3.6,18 to 4.8,19.7
bKeepout: area 40.8,10.2 to 45.9,29.2; area 0,14.1 to 3.6,26.7; area 3.6,18 to 4.8,19.8
tRestrict: area 40.8,10.2 to 45.9,29.2; area 56.1,1.1 to 58.9,3.9; area 1.1,1.1 to 3.9,3.9; area 1.1,41.1 to 3.9,43.9; area 56.1,41.1 to 58.9,43.9
bRestrict: area 56.1,1.1 to 58.9,3.9; area 56.1,41.1 to 58.9,43.9; area 1.1,41.1 to 3.9,43.9; area 1.1,1.1 to 3.9,3.9; area -0.3,14.4 to 4.7,26.7; area 40.8,10.2 to 45.8,29.2
Milling: 4 lines

### Footprints (pad centres in the part's own frame; a part is rotated, then mirrored left to right if it is on the bottom)
0805_NOTHERMALS = smd 1.3 x 1.5: 1 -0.95,0; 2 0.95,0
TP10R = smd 1 x 1: TP 0,0
TFT_1.3IN_240X240_24P = smd 0.28 x 1.25: 1 4.55,13.378; 2 5.05,13.378; 3 5.55,13.378; 4 6.05,13.378; 5 6.55,13.378; 6 7.05,13.378; 7 7.55,13.378; 8 8.05,13.378; 9 8.55,13.378; 10 9.05,13.378; 11 9.55,13.378; 12 10.05,13.378; 13 10.55,13.378; 14 11.05,13.378; 15 11.55,13.378; 16 12.05,13.378; 17 12.55,13.378; 18 13.05,13.378; 19 13.55,13.378; 20 14.05,13.378; 21 14.55,13.378; 22 15.05,13.378; 23 15.55,13.378; 24 16.05,13.378 | smd 2.3 x 3.1: MNT1 2.88,11.722; MNT2 17.72,11.722
SOD-123 = smd 1.4 x 1.4: A 1.85,0; C -1.85,0
LGA16_3X3MM = smd 0.5 x 0.25: 1 -1.35,1; 2 -1.35,0.5; 3 -1.35,0; 4 -1.35,-0.5; 5 -1.35,-1; 9 1.35,-1; 10 1.35,-0.5; 11 1.35,0; 12 1.35,0.5; 13 1.35,1 | smd 0.25 x 0.5: 6 -0.5,-1.35; 7 0,-1.35; 8 0.5,-1.35; 14 0.5,1.35; 15 0,1.35; 16 -0.5,1.35
SOIC8_150MIL = smd 0.6 x 2.2: 1 -1.905,-2.6; 2 -0.635,-2.6; 3 0.635,-2.6; 4 1.905,-2.6; 5 1.905,2.6; 6 0.635,2.6; 7 -0.635,2.6; 8 -1.905,2.6
U.FL-R-SMT(10) = smd 1.05 x 2.2: GND -1.475,0; GND1 1.475,0 | smd 1 x 1: SIG 0,-1.525
1X06_ROUND = drill 1 pad 1.676: 1 -6.35,0; 2 -3.81,0; 3 -1.27,0; 4 1.27,0; 5 3.81,0; 6 6.35,0
_0805MP = smd 1.2 x 1.3: 1 -1.016,0; 2 1.016,0
RGBLED_PLCC4 = smd 1.1 x 1: 1 -1.4,0.6; 2 -1.4,-0.6; 3 1.4,-0.6; 4 1.4,0.6
CHIPLED_0805_NOOUTLINE = smd 1.2 x 1.2: A 0,-1.05; C 0,1.05
MDBT50 = smd 0.6 x 0.4: 1 -4.65,3.75; 2 -4.65,2.65; 3 -4.65,1.85; 4 -4.65,0.25; 5 -3.75,-0.15; 6 -4.65,-0.55; 7 -3.75,-0.95; 8 -4.65,-1.35; 9 -3.75,-1.75; 10 -4.65,-2.15; 11 -3.75,-2.55; 12 -4.65,-2.95; 13 -3.75,-3.35; 14 -4.65,-3.75; 34 4.65,-6.15; 35 4.65,-5.35; 36 3.75,-4.95; 37 4.65,-4.55; 38 3.75,-4.15; 39 4.65,-3.75; 40 3.75,-3.35; 41 4.65,-2.95; 42 3.75,-2.55; 43 3.75,-1.75; 44 4.65,-1.35; 45 3.75,-0.95; 46 4.65,-0.55; 47 3.75,-0.15; 48 4.65,0.25; 49 3.75,0.65; 50 3.75,1.45; 51 4.65,1.85; 52 3.75,2.25; 53 4.65,2.65; 54 3.75,3.05; 55 4.65,3.75 | smd 0.4 x 0.6: 15 -4.8,-7.15; 16 -4,-7.15; 17 -3.2,-7.15; 18 -2.4,-7.15; 19 -2,-6.25; 20 -1.6,-7.15; 21 -1.2,-6.25; 22 -0.8,-7.15; 23 -0.4,-6.25; 24 0,-7.15; 25 0.4,-6.25; 26 0.8,-7.15; 27 1.2,-6.25; 28 1.6,-7.15; 29 2,-6.25; 30 2.4,-7.15; 31 3.2,-7.15; 32 4,-7.15; 33 4.8,-7.15; 56 -2,-0.55; 57 -1.2,-0.55; 58 -0.4,-0.55; 59 0.4,-0.55; 60 1.2,-0.55; 61 2,-0.55
SOT23-R@1 = smd 0.635 x 1.016: 1 -0.95,-1; 2 0.95,-1; 3 0,1
SOT23-R = smd 0.635 x 1.016: 1 -0.95,-1; 2 0.95,-1; 3 0,1
SOT23-WIDE = smd 1 x 1.27: 1 -0.95,-1; 2 0.95,-1; 3 0,1
RESPACK_4X0603 = smd 0.65 x 0.8: 1 -1.3,-0.75; 4 1.3,-0.75; 5 1.3,0.75; 8 -1.3,0.75 | smd 0.5 x 0.8: 2 -0.4,-0.75; 3 0.4,-0.75; 6 0.4,0.75; 7 -0.4,0.75
6MMX6MM_TACTILE_SMT = smd 2 x 1.2: A -3.5,-2.25; A' 3.5,-2.25; B -3.5,2.25; B' 3.5,2.25
BTN_KMR2_4.6X2.8 = smd 0.9 x 0.9: A 2.05,0.8; A' -2.05,0.8; B 2.05,-0.8; B' -2.05,-0.8
APDS-9960 = smd 0.6 x 0.72: 1 0.7,1.505; 2 0.7,0.505; 3 0.7,-0.495; 4 0.7,-1.495; 5 -0.7,-1.495; 6 -0.7,-0.495; 7 -0.7,0.505; 8 -0.7,1.505
SOT23-5 = smd 0.55 x 1.2: 1 -0.95,-1.3; 2 0,-1.3; 3 0.95,-1.3; 4 0.95,1.3; 5 -0.95,1.3
4UCONN_20329_V2 = smd 1 x 2: BASE@1 -0.75,-2; BASE@2 0.75,-2 | smd 0.4 x 1.35: D+ 0,0.775; D- -0.65,0.775; GND 1.3,0.775; ID 0.65,0.775; VBUS -1.3,0.775 | drill 0.8 pad 1.143 offset: SPRT@1 -3.3,0.9; SPRT@2 3.3,0.9 | drill 0.9 pad 2.413 square: SPRT@3 -3.6,-1.9; SPRT@4 3.6,-1.9 | hole 0.7: -1.95,0; 1.95,0
JSTPH2 = smd 1 x 4.6: 1 -1,-3.7; 2 1,-3.7 | smd 1.6 x 3.4: NC1 -3.4,1.5; NC2 3.4,1.5
JSTPH2_NOTHERMALS = smd 1 x 4.6: 1 -1,-3.7; 2 1,-3.7 | smd 1.6 x 3.4: NC1 -3.4,1.5; NC2 3.4,1.5

### Placement (x,y rotation side)
C1_1  32,40.5 0 top
C1_2  52,2.5 0 top
C1_3  37,40.5 180 top
C1_4  37,42.5 180 top
C1_5  41.5,40.5 0 top
C1_6  41.5,42.5 0 top
C1_7  27,42.5 180 top
C1_8  57,12.5 270 top
C1_9  32,42.5 0 top
C1_10  47,2.5 0 top
C2_1  18.81,34.36 0 top
C3_1  27,40.5 180 top
C4_1  3,32.5 0 top
C4_2  3,34.5 0 top
C4_3  7,39.5 0 top
C4_4  7,41.5 0 top
D+  50,33.5 0 top
D-  49.5,39 180 top
DISPLAY1  45.88,8.89 90 top
DS1_1  53,14 90 top
DS2_1  18.81,32.36 180 top
IC1  26.5,23 270 top
IC2  9.5,32.5 0 top
J1  2.5,38 90 top
J2  23.44,1.95 0 top
L1  20,23 270 top
LED1  35,37.5 0 bottom
LED_C  49.5,12 180 top
MDBT50Q-1MV2  7.5,20.5 90 top
Q1_1  53,9 90 top
Q2_1  17.55,29.95 0 top
Q5_1  27,11.5 0 top
R1_1  49.5,8 270 top
R1_2  57,16 180 top
R2_1  40,38.5 0 top
R2_2  40,36.5 0 top
R2_3  34,37 270 top
R2_4  13.66,30.28 90 top
R3_1  27.5,29.5 90 top
R3_2  29.5,29.5 90 top
R4_1  49,37 180 top
R4_2  49,35 180 top
R4_3  2,29.5 270 top
R4_4  4,29.5 90 top
R5_1  24,11.5 90 top
R5_2  30.61,12.06 90 top
RG1_1  49,17.5 180 top
SW_1  9.51,6.48 90 bottom
SW_2  9.52,38.5 90 bottom
SW_3  50.5,6.5 270 bottom
SW_4  50,38.5 270 bottom
SW_R  14.5,11 270 top
U1  29.5,37.5 270 bottom
U2  48,24 0 top
U3  53,5.5 270 top
X1  55.5,22.5 90 top
X2  38,4 180 top
X3  18.94,41.61 0 top

### Tracks (layer width: path | path; a pad name or v marks a point on that pad's centre or on a via)
3.3V  (via drill 0.39)  (2 unrouted)
  Top 0.203: 25.41,24.39 IC1.5 | 27.76,23.57 IC1.16 | 27.55,24.29 IC1.1 | 33.57,13.44 DISPLAY1.1 | DISPLAY1.4 32.5,15.5 DISPLAY1.6
  Top 0.406: C1_6.2 42.22,42.27 | C1_3.2 36.02,40.51 36.02,42.45 C1_4.2 | C3_1.2 26.13,40.58 | C1_4.2 35.82,42.45 33.17,42.45 C1_9.2 32.96,42.45 32.96,40.51 C1_1.2 32.86,40.31 31.84,39.29 27.18,39.29 | C1_4.2 36.13,42.66 37.15,43.68 41.35,43.68 41.61,43.42 41.61,43.34 C1_6.2 | 25.41,28.47 25.41,24.39 | 25.41,28.47 27.45,30.51 R3_1.2 27.66,30.41 29.29,30.41 R3_2.2 29.59,30.51 30.72,29.39 30.72,27.19 27.68,24.16 | 27.76,23.57 27.76,24.08 27.68,24.16 | 27.55,24.29 27.68,24.16 | MDBT50Q-1MV2.30 14.7,22.86 14.7,22.14 MDBT50Q-1MV2.28 14.8,22.04 18.06,22.04 19.18,20.92 20.82,20.92 21.12,21.23 21.12,22.86 20,23.98 L1.1 20.1,24.19 20.1,29.44 | 20.63,33.5 20.63,32.37 DS2_1.C 20.63,32.17 20.63,31.25 19.46,30.08 | 20.63,33.5 19.81,34.31 C2_1.2 19.76,34.78 19.94,35.05 X3.2 | 19.46,30.08 19.3,29.92 15.68,29.92 15.68,35.18 13.71,37.15 10.15,37.14 8.87,37.14 7.65,35.92 7.65,35.1 IC2.8 | 20.1,29.44 20.1,29.49 21.94,29.49 22.86,28.57 25.31,28.57 25.41,28.47 | 19.46,30.08 20.1,29.44 | C3_1.2 25.05,40.5 23.55,39 23.55,36.42 20.63,33.5 | 34.59,23.5 34.59,16.09 33.57,15.07 33.57,13.44 | 34.59,23.5 34.59,23.69 | U2.5 47.05,28.71 45.91,29.84 40.41,29.84 v40.15,29.59 40.15,29.06 34.59,23.5 | R5_1.2 24.08,12.45 25.21,12.45 28.2,15.44 DISPLAY1.5 | 23.88,12.35 R5_1.2 | 33.57,15.41 33.48,15.5 32.5,15.5 | C1_5.2 C1_6.2 | C3_1.2 26.89,39.66 26.89,39.58 27.18,39.29 | C3_1.2 C1_7.2 | 27.18,39.29 26.9,39 v26.9,38.29 | R5_1.2 23.69,12.14 22.32,12.14 21.85,11.67 21.85,11.35 v17.5,7
  Bottom 0.406: 30.92,38.58 30.92,38.27 U1.5 31,38.65 31.43,39.09 31.5,39.09 | 31.5,39.09 34.29,39.09 34.59,38.78 34.59,38.27 35.92,36.94 36.33,36.94 LED1.2 36.53,36.74 37.76,36.74 40.15,34.34 v40.15,29.59 | v26.9,38.29 27.91,38.29 U1.8 28.06,38.27 28.06,41.48 30.51,41.48 31.5,40.5 31.5,39.09 | v17.5,7 19.63,4.87 J2.2
APDS_IRQ  (via drill 0.39)
  Top 0.203: v9.9,17.66 9.08,18.47 8.06,18.47 MDBT50Q-1MV2.56 | v13.02,10.65 19.02,10.65 v20.21,11.84 | v22.3,15.43 23.29,15.43 25.92,18.06 v26.98,18.06
  Bottom 0.203: v9.9,17.66 9.9,14.19 13.02,11.06 v13.02,10.65 | v20.21,11.84 21.12,11.84 22.35,10.61 22.96,10.61 23.37,11.02 23.37,11.74 21.53,13.57 21.53,14.66 v22.3,15.43 | v26.98,18.06 26.98,18.84 26.64,19.18 26.64,26.74 28.98,29.08 28.98,36.74 U1.2
D+  (via drill 0.39)
  Top 0.203: R4_2.1 50.01,34.9 50.01,33.57 D+.TP 50.01,33.47 v50.01,26.53 | v51.64,24.9 53.98,22.55 54.7,22.55 X1.D+
  Bottom 0.203: v50.01,26.53 v51.64,24.9
D-
  Top 0.203: D-.TP 49.6,38.98 49.6,37.35 49.9,37.04 R4_1.1 50.01,36.94 50.92,36.02 50.92,24.59 53.58,21.94 54.7,21.94 X1.D-
DCCH
  Top 0.203: MDBT50Q-1MV2.31 14.7,23.68 18.27,23.68 19.9,22.04 L1.2
EN
  Top 0.203: RG1_1.2 49.39,18.27 49.39,22.25 48.98,22.66 U2.3
GND  (via drill 0.39)
  Top 0.203: DISPLAY1.3 30.95,14.44 30.73,14.22 | MDBT50Q-1MV2.55 3.88,25.02 3.88,23.89 4,23.77 4,21.91 v4.19,21.72 | v13.56,15.62 13.64,15.7 MDBT50Q-1MV2.15 | 29,23 IC1.15 26.01,23 26,22.99 | DISPLAY1.23 DISPLAY1.24 | DISPLAY1.20 DISPLAY1.19 | DISPLAY1.11 32.55,18.49 33.25,18.49 33.26,18.5 33.5,18.5 33.5,19.5 32.56,19.5 DISPLAY1.13 DISPLAY1.14 | RG1_1.6 48.84,16.99 48.84,17.28 49.11,17.54 49.78,17.54 49.96,17.72 49.96,17.91 RG1_1.1 | X1.GND 53.7,23.8 53.5,24 | v45,7.5 46,7.5 48,5.5 U3.2 | IC1.4 26,22.99 | 26,22.99 26,22.53 26.03,22.5 IC1.8 25.15,21.98 v24.51,21.34 24.51,21.51 | MDBT50Q-1MV2.1 MDBT50Q-1MV2.2
  Bottom 0.203: v6.07,22.59 5.79,22.31 5.79,21.92 5.38,21.51 4.79,21.51 4.58,21.72 v4.19,21.72
  other vias: 14,39 9.5,38.5 6,30 24,42 46.5,38.5 55.5,37 51,22 55,13.5 43.5,2.5 31.5,7 39,14 29.36,9.91 34,24.5 28.7,14.1 30,23 16.27,26.56 23,23.5 5,17 3.5,10.5 14.5,5 17.73,9.67 17,12 11.49,32.26 13,36 4.26,36.4 20.7,8.89 20.6,3.02 29.5,42.5 39.24,41.53 29.5,40.5 48.5,21 13.17,32.82 22.45,36.79 23.59,27.11 49.78,1.52 33,31.5 43.5,32 23,5.5 37.5,29 39,24.5 48.5,30.5 18.5,25.5 25,38 18.67,24.34 31.99,35.31 43.72,36.27 18.89,42.64 18.91,31.84 22.03,32.33 25.05,29.48 57.6,6.66 37.74,3.28 7,6.5 19.5,13 19.5,15.5 10,12.5
  pour Top (isolate 0.406): 0,0 0,45 60,45 60,0
  pour Bottom (isolate 0.406): 0,0 0,45 60,45 60,0
HAPTIC
  Top 0.203: MDBT50Q-1MV2.37 12.14,25.21 12.14,26 12.14,26.02 12.14,26.31 13.66,27.83 R2_4.1
LED1  (via drill 0.39)
  Top 0.203: v12.21,23.26 12.08,23.14 12.08,21.63 12.79,20.92 13.68,20.92 MDBT50Q-1MV2.25 | v22.44,33.44 26.34,37.34 30.71,37.34 32.45,39.09 v35.41,39.09 | v42.25,39.09 41.53,39.09 41.02,38.58 R2_1.2
  Bottom 0.203: v12.21,23.26 12.21,26.39 19.26,33.44 v22.44,33.44 | v42.25,39.09 v35.41,39.09
LED2  (via drill 0.39)
  Top 0.203: v21.58,28.44 21.7,28.32 21.7,20.99 21.12,20.41 18.88,20.41 18.06,21.23 14.7,21.23 MDBT50Q-1MV2.26 | v27.25,34.29 27.25,34.33 28.94,36.02 33.98,36.02 R2_3.2
  Bottom 0.203: v27.25,34.29 27.25,34.11 v21.58,28.44
LED3  (via drill 0.39)
  Top 0.203: v12.81,21.94 13.02,21.74 13.68,21.74 MDBT50Q-1MV2.27 | v25.31,31.12 26.29,31.12 28.44,33.27 v36.43,33.27 | v38.05,35.11 39.6,35.11 40.92,36.43 R2_2.2
  Bottom 0.203: v12.81,21.94 13.07,22.19 13.62,22.19 18.37,26.94 21.13,26.94 v25.31,31.12 | v38.05,35.11 36.43,33.49 v36.43,33.27
LEDK
  Top 0.203: DISPLAY1.2 32.45,13.98 31.53,13.98 31.45,13.86 R5_2.2
LSM_IRQ
  Top 0.203: MDBT50Q-1MV2.57 8.05,19.28 9.88,19.32 12.68,16.51 12.68,14.84 16.24,14.84 19.88,18.47 22.25,18.47 23.37,19.59 23.37,21.53 24.8,22.96 25.1,22.96 IC1.7
N$1
  Top 0.203: LED_C.C 49.51,10.91 49.51,8.97 R1_1.1
N$2
  Bottom 0.203: U1.3 30,36.84 30.92,36.84 U1.4
N$3  (via drill 0.39)
  Top 0.203: v35.41,35.92 38.47,35.92 38.98,36.43 R2_2.1
  Bottom 0.203: v35.41,35.92 34.49,36.84 33.68,36.84 LED1.3
N$4
  Top 0.203: Q5_1.3 27.04,12.45 29.35,12.45 R5_2.1
N$5  (via drill 0.39)
  Top 0.203: R2_3.1 33.96,37.91 v32.34,37.91
  Bottom 0.203: v32.34,37.91 33.46,37.91 LED1.4
N$6
  Top 0.203: R4_3.1 2.04,30.51 2.04,32.45 C4_1.1 2.04,32.55 C4_2.1 2.14,34.59 2.45,34.9 2.45,36.43 J1.GND 2.55,36.53 2.55,39.39 J1.GND1
N$7
  Top 0.203: 17.82,34.34 17.77,34.31 17.77,33.09 17.06,32.37 DS2_1.A 17.06,32.27 17.06,31.44 Q2_1.3 | 17.82,34.34 C2_1.1 | X3.1 17.94,34.47 17.95,34.46 17.82,34.34
N$8
  Top 0.203: 4.64,38.12 6.02,39.49 C4_3.1 6.02,39.59 6.02,41.43 C4_4.1 | 4.64,38.12 4.59,38.06 4.08,38.06 J1.SIG | 4.64,38.12 5,37.76 5,31.64 4.08,30.72 4.08,30.51 R4_4.2
N$9
  Top 0.203: Q2_1.1 16.14,29.41 15.47,29.41 15.17,29.71 15.17,29.72 R2_4.2
N$10  (via drill 0.39)
  Top 0.203: v37.76,38.17 38.68,38.17 38.98,38.47 R2_1.1
  Bottom 0.203: v37.76,38.17 36.43,38.17 LED1.1
N$11
  Top 0.203: U3.1 51.64,6.53 49.62,6.53 R1_1.2
N$12
  Top 0.203: U3.5 54.39,6.53 54.8,6.53 58.68,10.41 58.68,15.21 57.96,15.92 R1_2.1
NFC1  (via drill 0.39)
  Top 0.203: v5.21,23.27 5.21,24.19 MDBT50Q-1MV2.52 | v5.1,27.35 3.98,28.47 R4_4.1
  Bottom 0.203: v5.21,23.27 5.21,23.88 4.49,24.59 4.49,26.74 v5.1,27.35
NFC2
  Top 0.203: MDBT50Q-1MV2.54 4.39,24.29 4.39,24.59 4.29,24.7 4.29,26.23 2.04,28.47 R4_3.2
QSPI_CS
  Top 0.203: MDBT50Q-1MV2.44 8.88,25.21 8.88,28.06 9.49,28.68 9.49,31.12 9.29,31.33 8.37,31.33 7.65,30.61 7.65,29.9 IC2.1
QSPI_DATA0
  Top 0.203: MDBT50Q-1MV2.41 10.51,25.21 10.51,27.14 12.3,28.93 12.3,34.14 11.43,35 IC2.5
QSPI_DATA1
  Top 0.203: MDBT50Q-1MV2.46 8.06,25.21 8.06,28.47 8.78,29.19 8.78,29.8 IC2.2
QSPI_DATA2  (via drill 0.39)
  Top 0.203: v8.17,23.31 8.17,23.78 8.37,23.98 8.37,24.19 MDBT50Q-1MV2.45 | v9.18,32.04 10.1,31.12 10.1,29.9 IC2.3
  Bottom 0.203: v8.17,23.31 8.17,31.03 v9.18,32.04
QSPI_DATA3  (via drill 0.39)
  Top 0.203: v9.18,23.27 9.18,24.19 MDBT50Q-1MV2.43 | v8.88,33.37 8.88,35 IC2.7
  Bottom 0.203: v9.18,23.27 9.18,31.02 9.9,31.74 9.9,32.35 v8.88,33.37
QSPI_SCK  (via drill 0.39)
  Top 0.203: v9.9,28.06 9.9,24.7 10,24.59 10,24.29 MDBT50Q-1MV2.42 | v9.9,33.37 9.9,34.8 10.1,35 IC2.6
  Bottom 0.203: v9.9,28.06 9.9,31.12 10.31,31.53 10.31,32.96 v9.9,33.37
RESET  (via drill 0.39)
  Top 0.203: 12.91,12.2 13.68,12.96 SW_R.B' | 12.91,12.2 12.25,11.53 12.25,10.41 13.68,8.98 SW_R.B | v12.67,18.39 10.92,20.15 10.92,24.19 MDBT50Q-1MV2.40 | v12.65,12.45 12.91,12.2
  Bottom 0.203: v12.67,18.39 12.67,12.47 v12.65,12.45 13.75,12.45 22.14,4.05 22.14,1.95 J2.3
SCL  (via drill 0.39)
  Top 0.203: v10.21,23.27 9.49,22.55 8.06,22.55 MDBT50Q-1MV2.61 | R3_2.1 29.59,28.47 v29.59,27.25 29.09,27.25 27,25.15 IC1.2
  Bottom 0.203: v10.21,23.27 10.21,27.35 10.71,27.86 10.71,33.27 10.61,33.37 10.61,43.68 10.82,43.88 12.25,43.88 15.82,40.31 15.82,35.96 17.36,34.41 24.42,34.41 27.53,37.52 28.61,37.52 29,37.91 U1.7 28.98,37.96 29.39,37.55 31.43,37.55 31.74,37.25 31.74,36.43 29.59,34.29 v29.59,27.25
SDA  (via drill 0.39)
  Top 0.203: 26.53,27.35 26.53,27.55 27.45,28.47 R3_1.1 | 26.53,27.35 26.53,24.39 IC1.3 | v26.09,16.55 25.73,16.55 23.68,14.49 23.68,14.29 16.04,6.66 12.86,6.66 6.63,12.89 6.63,20.51 7.76,21.64 7.96,21.64 MDBT50Q-1MV2.60 | v26.23,27.35 26.53,27.35
  Bottom 0.203: 26.09,27.35 v26.09,16.55 | U1.1 28.03,36.76 28.03,34.05 26.02,32.04 26.02,27.35 26.09,27.35 | 26.09,27.35 v26.23,27.35
SWCLK  (via drill 0.39)
  Top 0.203: v5.21,26.33 4.9,26.02 4.9,25.21 MDBT50Q-1MV2.53 | v13.38,16.66 9.63,20.41 v9.29,20.41
  Bottom 0.203: v5.21,26.33 5.21,24.49 v9.29,20.41 | v13.38,16.66 14.26,16.66 27.25,3.67 J2.5
SWIO  (via drill 0.39)
  Top 0.203: v6.12,27.35 6.12,26.23 5.71,25.82 5.71,25.21 MDBT50Q-1MV2.51 | v5.08,22.22 5.08,21.86 6.22,20.71 6.22,12.69 12.65,6.26 25.48,6.26 J2.6
  Bottom 0.203: v6.12,27.35 5.41,28.06 4.8,28.06 4.08,27.35 4.06,22.99 4.83,22.22 v5.08,22.22
SWITCH_A  (via drill 0.39)
  Top 0.203: v7.35,14.7 7.35,15.82 MDBT50Q-1MV2.4
  Bottom 0.203: v7.35,14.7 7.35,12.96 10.33,9.98 SW_1.B' 11.53,9.8 11.53,3.16 SW_1.B
SWITCH_B  (via drill 0.39)
  Top 0.203: v7.65,17.66 7.65,16.84 MDBT50Q-1MV2.5
  Bottom 0.203: v7.65,17.66 11.5,21.5 11.5,27 15,30.5 15,35 11.43,35 SW_2.B 11.53,35.1 11.53,41.84 SW_2.B'
SWITCH_C  (via drill 0.39)
  Top 0.203: v22.25,13.88 8.8,13.88 8.06,14.61 8.06,15.82 MDBT50Q-1MV2.6
  Bottom 0.203: v22.25,13.88 23.68,13.88 28.37,9.18 47.76,9.18 47.81,9.24 | 47.81,9.24 48.47,9.9 SW_3.B | 47.81,9.24 48.47,8.57 48.47,3.16 SW_3.B'
SWITCH_D  (via drill 0.39)
  Top 0.203: v8.88,17.66 8.47,17.25 8.47,16.84 MDBT50Q-1MV2.7
  Bottom 0.203: v8.88,17.66 11.63,20.41 20.21,20.41 31.02,9.59 45.82,9.59 46.94,10.72 46.94,33.98 47.96,35 SW_4.B' 48.07,35.1 48.07,41.84 SW_4.B
SWO  (via drill 0.39)
  Top 0.203: MDBT50Q-1MV2.47 7.65,23.79 7.44,23.58 7.44,22.44 v6.5,21.5 | v10.82,6 12.33,6 12.48,5.85 21.09,5.85 24.71,2.23 J2.4
  Bottom 0.203: v6.5,21.5 6.5,13 11.12,8.38 11.12,6.3 v10.82,6
TFT_BACKLIGHT  (via drill 0.39)
  Top 0.203: v16.02,16.53 14.7,16.53 MDBT50Q-1MV2.16 | v22.66,11.33 23.26,11.33 23.98,10.61 R5_1.1 24.08,10.51 26.02,10.51 Q5_1.1
  Bottom 0.203: v16.02,16.53 16.08,16.47 20.97,16.47 21.12,16.32 21.12,12.87 v22.66,11.33
TFT_CS  (via drill 0.39)
  Top 0.203: v17.55,18.06 14.7,18.06 MDBT50Q-1MV2.18 | v27.35,16.44 26.77,15.87 26.3,15.87 24.61,14.19 v24.39,14.19 | v31.23,16.43 31.74,16.94 32.45,16.94 DISPLAY1.8
  Bottom 0.203: v17.55,18.06 20.72,18.06 24.39,14.39 v24.39,14.19 | v31.23,16.43 31.22,16.44 v27.35,16.44
TFT_DC  (via drill 0.39)
  Top 0.203: v22.59,20.13 22.59,20.01 21.56,18.98 14.7,18.98 MDBT50Q-1MV2.20 | v25.31,19.9 26.94,19.9 v27.35,19.49 | v31.09,17.97 31.73,17.97 31.74,17.96 32.45,17.96 DISPLAY1.10
  Bottom 0.203: v25.31,19.9 25.07,20.13 v22.59,20.13 | v27.35,19.49 28.87,17.97 v31.09,17.97
TFT_MOSI  (via drill 0.39)
  Top 0.203: v19.9,19.7 14.7,19.7 MDBT50Q-1MV2.22 | v25.52,14.08 26.02,14.08 30.92,18.98 32.45,18.98 DISPLAY1.12
  Bottom 0.203: v25.52,14.08 v19.9,19.69 v19.9,19.7
TFT_RESET  (via drill 0.39)
  Top 0.203: v16.84,17.35 14.7,17.35 MDBT50Q-1MV2.17 | v20.41,17.35 24.59,17.35 26.02,18.78 v29.08,18.78 | v33.78,16.44 33.77,16.43 32.55,16.43 DISPLAY1.7
  Bottom 0.203: v20.41,17.35 v16.84,17.35 | v29.08,18.78 31.44,18.78 v33.78,16.44
TFT_SCK  (via drill 0.39)
  Top 0.203: v13.68,17.66 13.68,18.47 MDBT50Q-1MV2.19 | v18.05,15.64 18.05,16.01 20.1,18.06 22.45,18.06 25,20.61 v30.82,20.61 | v33.78,17.46 33.77,17.45 32.55,17.45 DISPLAY1.9
  Bottom 0.203: v13.68,17.66 13.88,17.66 16.2,15.33 17.74,15.33 v18.05,15.64 | v33.78,17.46 30.82,20.42 v30.82,20.61
USBD+  (via drill 0.39)
  Top 0.203: v14.75,27.44 12.86,25.55 12.86,25.21 MDBT50Q-1MV2.35 | v23.83,32.86 27.45,32.86 28.57,33.98 47.05,33.98 47.96,34.9 R4_2.2
  Bottom 0.203: v23.83,32.86 23.83,32.67 20.62,29.46 16.77,29.46 v14.75,27.44
USBD-  (via drill 0.39)
  Top 0.203: v16.3,27.77 16.17,27.77 13.65,25.26 MDBT50Q-1MV2.34 | v24.6,33.6 24.66,33.54 27.52,33.54 28.37,34.39 45.41,34.39 47.96,36.94 R4_1.2
  Bottom 0.203: v16.3,27.77 19.75,27.77 24.6,32.62 v24.6,33.6
VBAT  (via drill 0.39)
  Top 0.406: v47.83,15.73 47.83,16.72 RG1_1.5 | v51.23,10 51.23,9.8 51.94,9.08 Q1_1.3 | 50.53,4.49 51.64,4.49 U3.3 | X2.2 37.04,7.65 37.04,6.22 38.37,4.9 45.82,4.9 47.96,2.75 C1_10.2 47.96,2.55 49.9,4.49 50.53,4.49 | v50.48,4.66 50.53,4.61 50.53,4.49
  Bottom 0.406: v47.83,15.73 47.82,15.72 47.82,13.41 v51.23,10 51.13,9.9 51.13,5.31 v50.48,4.66
VBUS  (via drill 0.39)
  Top 0.406: 52.94,15.94 52.96,15.92 DS1_1.A 53.17,15.72 54.29,15.72 55.41,14.59 57.86,14.59 58.17,14.29 58.17,10.71 55.52,8.06 54.19,8.06 Q1_1.1 | 52.94,15.94 52.15,16.74 50.31,16.74 RG1_1.8 | Q1_1.1 53.98,7.96 53.98,7.65 53.27,6.94 53.27,5.61 54.29,4.59 U3.4 54.19,4.39 52.96,3.16 52.96,2.55 C1_2.2 | v16.94,24.49 14.7,24.49 MDBT50Q-1MV2.32 | v40.06,10.31 40.06,10.12 40.53,9.65 46.1,9.65 LED_C.A 49.51,12.95 53.88,8.57 53.88,8.16 Q1_1.1 | X1.VBUS 54.23,21.2 52.94,19.92 52.94,15.94
  Bottom 0.406: v16.94,24.49 31.12,10.31 v40.06,10.31
VDIV  (via drill 0.39)
  Top 0.203: v47.66,23.98 47.66,28.83 46.08,30.41 34.8,30.41 31.53,27.14 31.53,20.21 28.6,17.27 25.74,17.27 22.81,14.34 22.54,14.61 21.97,14.61 21.72,14.35 21.59,14.35 10.47,14.34 9.7,15.11 9.7,15.82 MDBT50Q-1MV2.10 | v47.66,19.29 47.66,18.27 RG1_1.4 47.76,18.27 48.58,18.27 RG1_1.3
  Bottom 0.203: v47.66,19.29 v47.66,23.98
VHI
  Top 0.406: 49.49,15.72 49.49,16.74 RG1_1.7 | 49.49,15.72 52.96,12.25 DS1_1.C 53.17,12.04 53.98,11.23 | 53.98,11.23 53.98,10 Q1_1.2 | 49.49,15.72 48.68,14.9 47.45,14.9 46.84,15.51 46.84,19.72 47.05,19.92 47.05,22.66 U2.1 | 53.98,11.23 54.29,11.53 56.94,11.53 C1_8.2

### Text on the board
tPlace: nrf52 FIDO2 Authenticator / by Steffensky